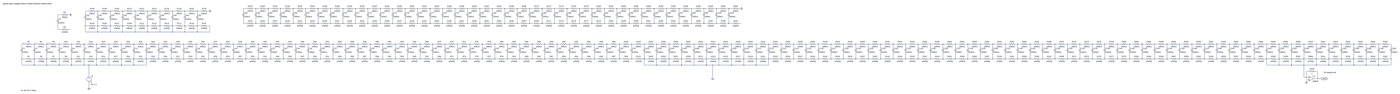
[diagram p0: schematic nstCircuitSim.asc, whole sheet]
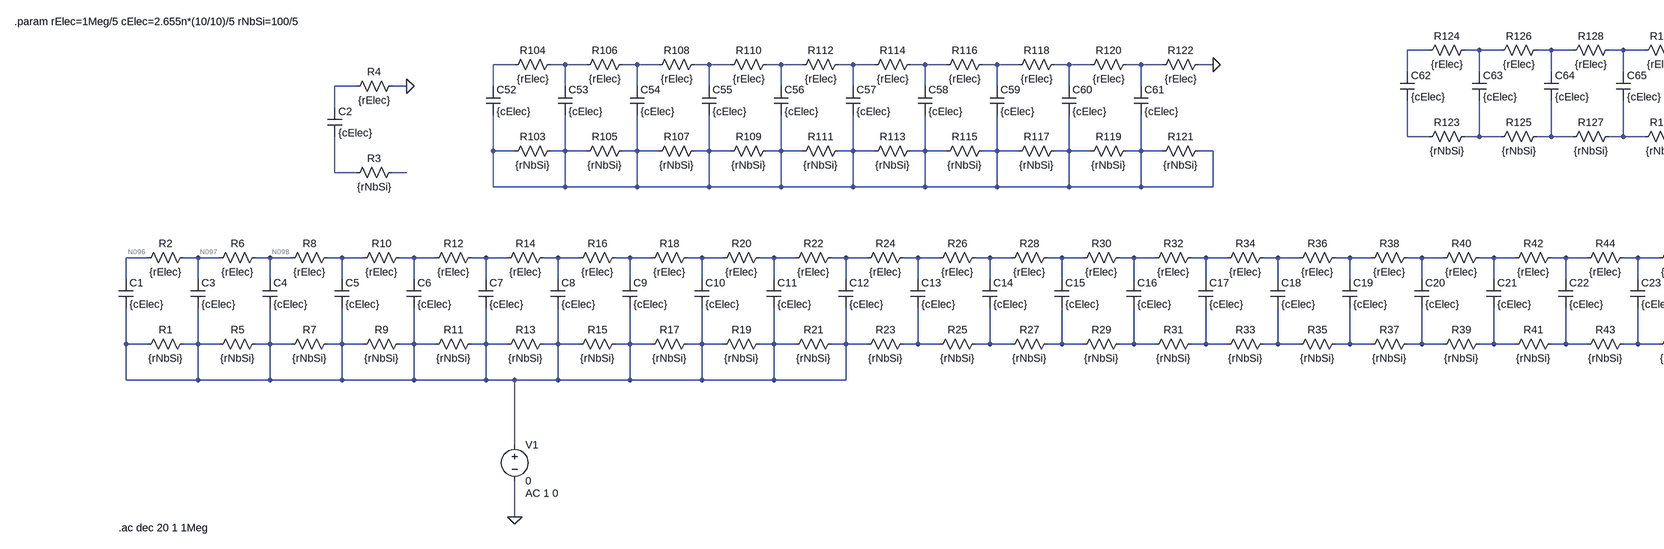
[diagram p1: schematic nstCircuitSim.asc, part, row 1 of 1, column 1 of 5]
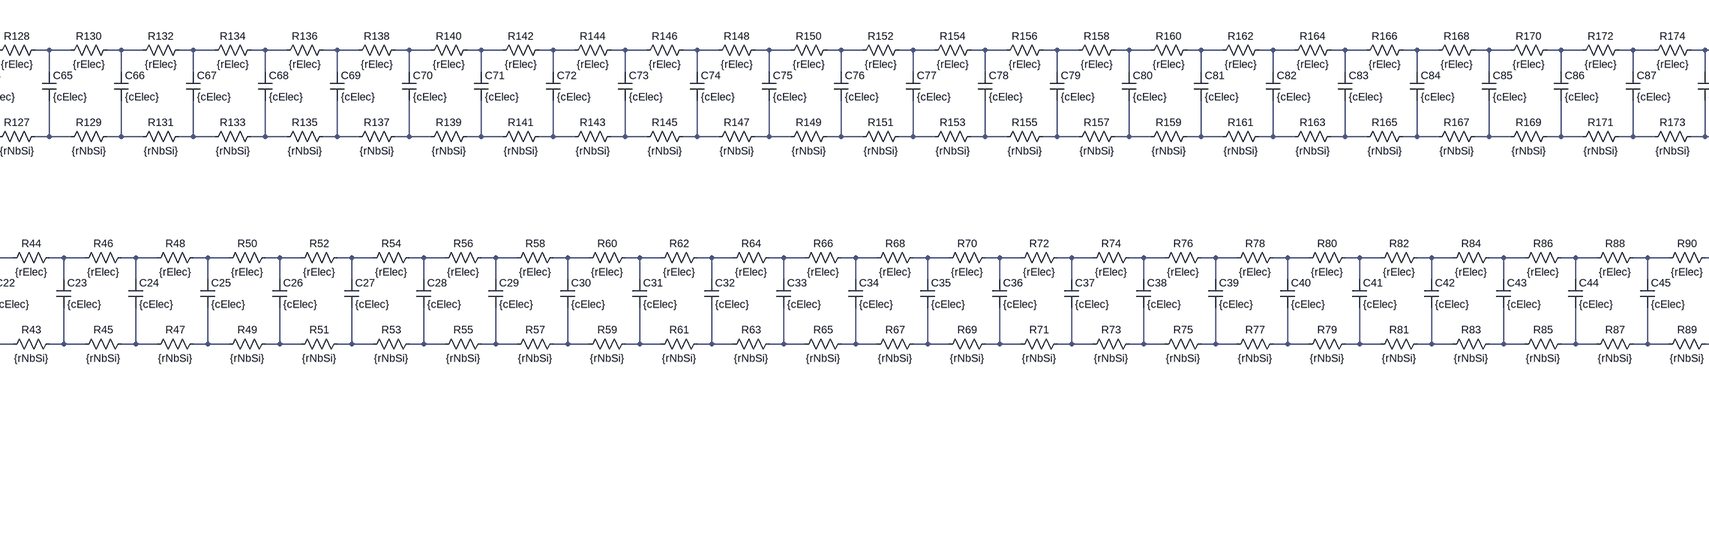
[diagram p2: schematic nstCircuitSim.asc, part, row 1 of 1, column 2 of 5]
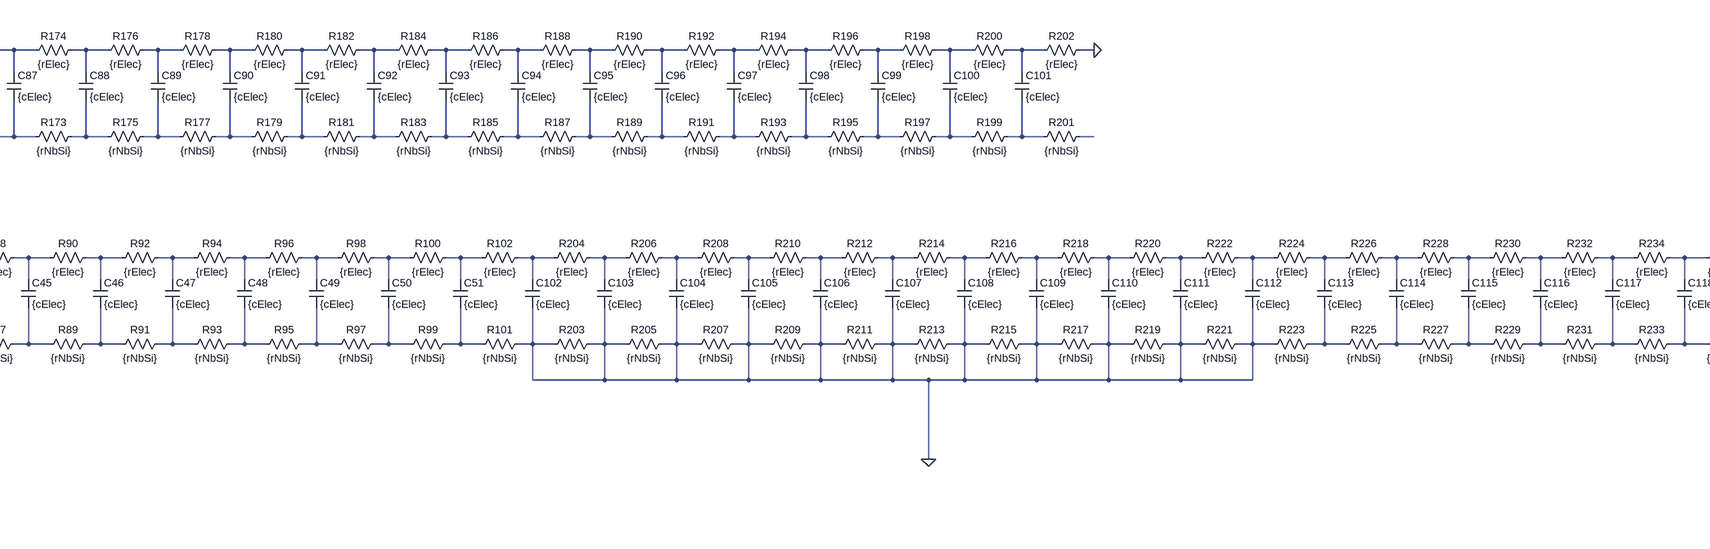
[diagram p3: schematic nstCircuitSim.asc, part, row 1 of 1, column 3 of 5]
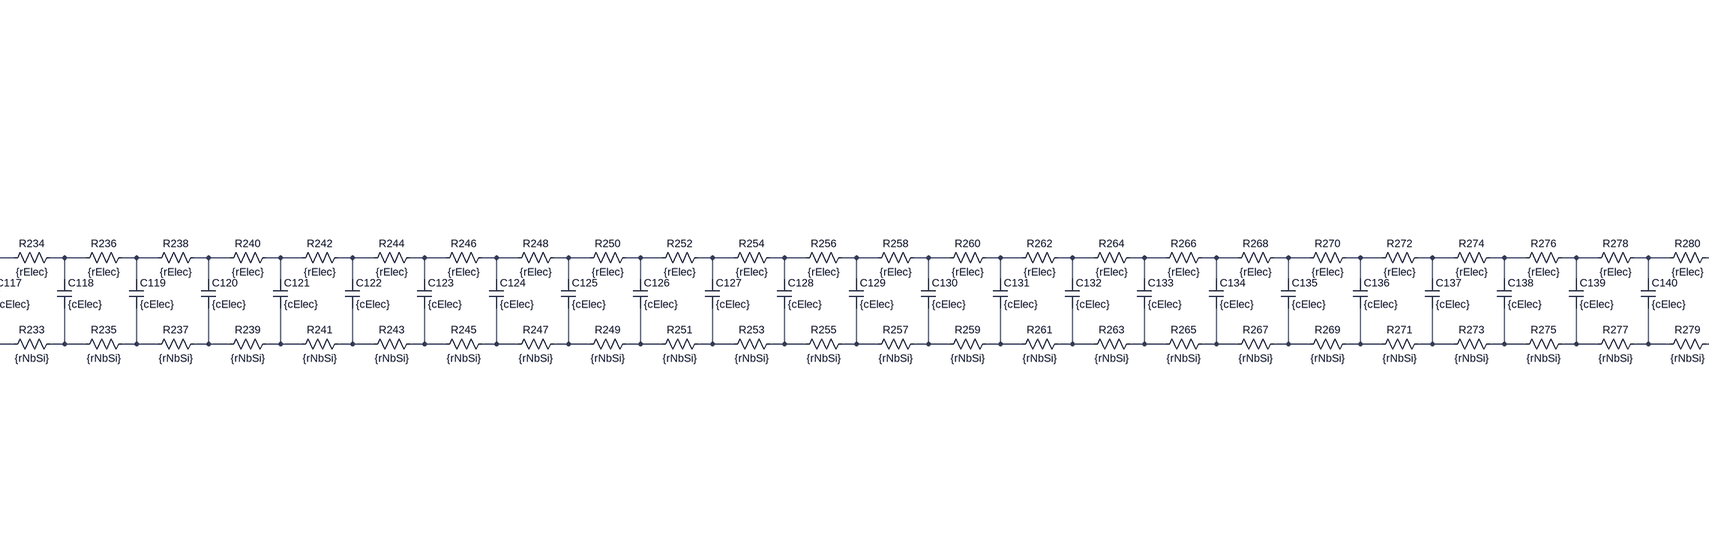
[diagram p4: schematic nstCircuitSim.asc, part, row 1 of 1, column 4 of 5]
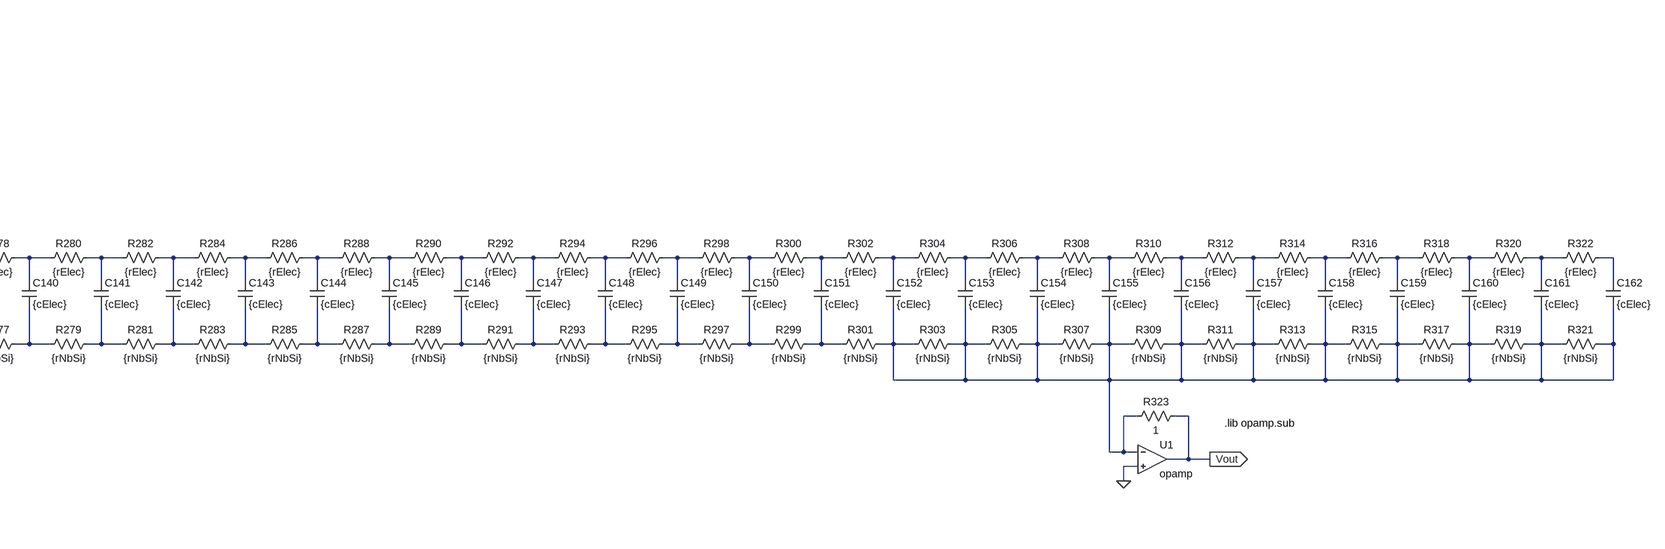
[diagram p5: schematic nstCircuitSim.asc, part, row 1 of 1, column 5 of 5]
* nstCircuitSim.asc
R1 N207 N207 {rNbSi}
R2 N097 N096 {rElec}
C1 N096 N207 {cElec}
R3 N095 N094 {rNbSi}
R4 0 N051 {rElec}
C2 N051 N094 {cElec}
R5 N207 N207 {rNbSi}
R6 N098 N097 {rElec}
C3 N097 N207 {cElec}
R7 N207 N207 {rNbSi}
R8 N099 N098 {rElec}
C4 N098 N207 {cElec}
R9 N207 N207 {rNbSi}
R10 N100 N099 {rElec}
C5 N099 N207 {cElec}
R11 N207 N207 {rNbSi}
R12 N101 N100 {rElec}
C6 N100 N207 {cElec}
R13 N207 N207 {rNbSi}
R14 N102 N101 {rElec}
C7 N101 N207 {cElec}
R15 N207 N207 {rNbSi}
R16 N103 N102 {rElec}
C8 N102 N207 {cElec}
R17 N207 N207 {rNbSi}
R18 N104 N103 {rElec}
C9 N103 N207 {cElec}
R19 N207 N207 {rNbSi}
R20 N105 N104 {rElec}
C10 N104 N207 {cElec}
R21 N207 N207 {rNbSi}
R22 N106 N105 {rElec}
C11 N105 N207 {cElec}
R23 N208 N207 {rNbSi}
R24 N107 N106 {rElec}
C12 N106 N207 {cElec}
R25 N209 N208 {rNbSi}
R26 N108 N107 {rElec}
C13 N107 N208 {cElec}
R27 N210 N209 {rNbSi}
R28 N109 N108 {rElec}
C14 N108 N209 {cElec}
R29 N211 N210 {rNbSi}
R30 N110 N109 {rElec}
C15 N109 N210 {cElec}
R31 N212 N211 {rNbSi}
R32 N111 N110 {rElec}
C16 N110 N211 {cElec}
R33 N213 N212 {rNbSi}
R34 N112 N111 {rElec}
C17 N111 N212 {cElec}
R35 N214 N213 {rNbSi}
R36 N113 N112 {rElec}
C18 N112 N213 {cElec}
R37 N215 N214 {rNbSi}
R38 N114 N113 {rElec}
C19 N113 N214 {cElec}
R39 N216 N215 {rNbSi}
R40 N115 N114 {rElec}
C20 N114 N215 {cElec}
R41 N217 N216 {rNbSi}
R42 N116 N115 {rElec}
C21 N115 N216 {cElec}
R43 N218 N217 {rNbSi}
R44 N117 N116 {rElec}
C22 N116 N217 {cElec}
R45 N219 N218 {rNbSi}
R46 N118 N117 {rElec}
C23 N117 N218 {cElec}
R47 N220 N219 {rNbSi}
R48 N119 N118 {rElec}
C24 N118 N219 {cElec}
R49 N221 N220 {rNbSi}
R50 N120 N119 {rElec}
C25 N119 N220 {cElec}
R51 N222 N221 {rNbSi}
R52 N121 N120 {rElec}
C26 N120 N221 {cElec}
R53 N223 N222 {rNbSi}
R54 N122 N121 {rElec}
C27 N121 N222 {cElec}
R55 N224 N223 {rNbSi}
R56 N123 N122 {rElec}
C28 N122 N223 {cElec}
R57 N225 N224 {rNbSi}
R58 N124 N123 {rElec}
C29 N123 N224 {cElec}
R59 N226 N225 {rNbSi}
R60 N125 N124 {rElec}
C30 N124 N225 {cElec}
R61 N227 N226 {rNbSi}
R62 N126 N125 {rElec}
C31 N125 N226 {cElec}
R63 N228 N227 {rNbSi}
R64 N127 N126 {rElec}
C32 N126 N227 {cElec}
R65 N229 N228 {rNbSi}
R66 N128 N127 {rElec}
C33 N127 N228 {cElec}
R67 N230 N229 {rNbSi}
R68 N129 N128 {rElec}
C34 N128 N229 {cElec}
R69 N231 N230 {rNbSi}
R70 N130 N129 {rElec}
C35 N129 N230 {cElec}
R71 N232 N231 {rNbSi}
R72 N131 N130 {rElec}
C36 N130 N231 {cElec}
R73 N233 N232 {rNbSi}
R74 N132 N131 {rElec}
C37 N131 N232 {cElec}
R75 N234 N233 {rNbSi}
R76 N133 N132 {rElec}
C38 N132 N233 {cElec}
R77 N235 N234 {rNbSi}
R78 N134 N133 {rElec}
C39 N133 N234 {cElec}
R79 N236 N235 {rNbSi}
R80 N135 N134 {rElec}
C40 N134 N235 {cElec}
R81 N237 N236 {rNbSi}
R82 N136 N135 {rElec}
C41 N135 N236 {cElec}
R83 N238 N237 {rNbSi}
R84 N137 N136 {rElec}
C42 N136 N237 {cElec}
R85 N239 N238 {rNbSi}
R86 N138 N137 {rElec}
C43 N137 N238 {cElec}
R87 N240 N239 {rNbSi}
R88 N139 N138 {rElec}
C44 N138 N239 {cElec}
R89 N241 N240 {rNbSi}
R90 N140 N139 {rElec}
C45 N139 N240 {cElec}
R91 N242 N241 {rNbSi}
R92 N141 N140 {rElec}
C46 N140 N241 {cElec}
R93 N243 N242 {rNbSi}
R94 N142 N141 {rElec}
C47 N141 N242 {cElec}
R95 N244 N243 {rNbSi}
R96 N143 N142 {rElec}
C48 N142 N243 {cElec}
R97 N245 N244 {rNbSi}
R98 N144 N143 {rElec}
C49 N143 N244 {cElec}
R99 N246 N245 {rNbSi}
R100 N145 N144 {rElec}
C50 N144 N245 {cElec}
R101 0 N246 {rNbSi}
R102 N146 N145 {rElec}
C51 N145 N246 {cElec}
R103 N093 N093 {rNbSi}
R104 N042 N041 {rElec}
C52 N041 N093 {cElec}
R105 N093 N093 {rNbSi}
R106 N043 N042 {rElec}
C53 N042 N093 {cElec}
R107 N093 N093 {rNbSi}
R108 N044 N043 {rElec}
C54 N043 N093 {cElec}
R109 N093 N093 {rNbSi}
R110 N045 N044 {rElec}
C55 N044 N093 {cElec}
R111 N093 N093 {rNbSi}
R112 N046 N045 {rElec}
C56 N045 N093 {cElec}
R113 N093 N093 {rNbSi}
R114 N047 N046 {rElec}
C57 N046 N093 {cElec}
R115 N093 N093 {rNbSi}
R116 N048 N047 {rElec}
C58 N047 N093 {cElec}
R117 N093 N093 {rNbSi}
R118 N049 N048 {rElec}
C59 N048 N093 {cElec}
R119 N093 N093 {rNbSi}
R120 N050 N049 {rElec}
C60 N049 N093 {cElec}
R121 N093 N093 {rNbSi}
R122 0 N050 {rElec}
C61 N050 N093 {cElec}
R123 N053 N052 {rNbSi}
R124 N002 N001 {rElec}
C62 N001 N052 {cElec}
R125 N054 N053 {rNbSi}
R126 N003 N002 {rElec}
C63 N002 N053 {cElec}
R127 N055 N054 {rNbSi}
R128 N004 N003 {rElec}
C64 N003 N054 {cElec}
R129 N056 N055 {rNbSi}
R130 N005 N004 {rElec}
C65 N004 N055 {cElec}
R131 N057 N056 {rNbSi}
R132 N006 N005 {rElec}
C66 N005 N056 {cElec}
R133 N058 N057 {rNbSi}
R134 N007 N006 {rElec}
C67 N006 N057 {cElec}
R135 N059 N058 {rNbSi}
R136 N008 N007 {rElec}
C68 N007 N058 {cElec}
R137 N060 N059 {rNbSi}
R138 N009 N008 {rElec}
C69 N008 N059 {cElec}
R139 N061 N060 {rNbSi}
R140 N010 N009 {rElec}
C70 N009 N060 {cElec}
R141 N062 N061 {rNbSi}
R142 N011 N010 {rElec}
C71 N010 N061 {cElec}
R143 N063 N062 {rNbSi}
R144 N012 N011 {rElec}
C72 N011 N062 {cElec}
R145 N064 N063 {rNbSi}
R146 N013 N012 {rElec}
C73 N012 N063 {cElec}
R147 N065 N064 {rNbSi}
R148 N014 N013 {rElec}
C74 N013 N064 {cElec}
R149 N066 N065 {rNbSi}
R150 N015 N014 {rElec}
C75 N014 N065 {cElec}
R151 N067 N066 {rNbSi}
R152 N016 N015 {rElec}
C76 N015 N066 {cElec}
R153 N068 N067 {rNbSi}
R154 N017 N016 {rElec}
C77 N016 N067 {cElec}
R155 N069 N068 {rNbSi}
R156 N018 N017 {rElec}
C78 N017 N068 {cElec}
R157 N070 N069 {rNbSi}
R158 N019 N018 {rElec}
C79 N018 N069 {cElec}
R159 N071 N070 {rNbSi}
R160 N020 N019 {rElec}
C80 N019 N070 {cElec}
R161 N072 N071 {rNbSi}
R162 N021 N020 {rElec}
C81 N020 N071 {cElec}
R163 N073 N072 {rNbSi}
R164 N022 N021 {rElec}
C82 N021 N072 {cElec}
R165 N074 N073 {rNbSi}
R166 N023 N022 {rElec}
C83 N022 N073 {cElec}
R167 N075 N074 {rNbSi}
R168 N024 N023 {rElec}
C84 N023 N074 {cElec}
R169 N076 N075 {rNbSi}
R170 N025 N024 {rElec}
C85 N024 N075 {cElec}
R171 N077 N076 {rNbSi}
R172 N026 N025 {rElec}
C86 N025 N076 {cElec}
R173 N078 N077 {rNbSi}
R174 N027 N026 {rElec}
C87 N026 N077 {cElec}
R175 N079 N078 {rNbSi}
R176 N028 N027 {rElec}
C88 N027 N078 {cElec}
R177 N080 N079 {rNbSi}
R178 N029 N028 {rElec}
C89 N028 N079 {cElec}
R179 N081 N080 {rNbSi}
R180 N030 N029 {rElec}
C90 N029 N080 {cElec}
R181 N082 N081 {rNbSi}
R182 N031 N030 {rElec}
C91 N030 N081 {cElec}
R183 N083 N082 {rNbSi}
R184 N032 N031 {rElec}
C92 N031 N082 {cElec}
R185 N084 N083 {rNbSi}
R186 N033 N032 {rElec}
C93 N032 N083 {cElec}
R187 N085 N084 {rNbSi}
R188 N034 N033 {rElec}
C94 N033 N084 {cElec}
R189 N086 N085 {rNbSi}
R190 N035 N034 {rElec}
C95 N034 N085 {cElec}
R191 N087 N086 {rNbSi}
R192 N036 N035 {rElec}
C96 N035 N086 {cElec}
R193 N088 N087 {rNbSi}
R194 N037 N036 {rElec}
C97 N036 N087 {cElec}
R195 N089 N088 {rNbSi}
R196 N038 N037 {rElec}
C98 N037 N088 {cElec}
R197 N090 N089 {rNbSi}
R198 N039 N038 {rElec}
C99 N038 N089 {cElec}
R199 N091 N090 {rNbSi}
R200 N040 N039 {rElec}
C100 N039 N090 {cElec}
R201 N092 N091 {rNbSi}
R202 0 N040 {rElec}
C101 N040 N091 {cElec}
R203 0 0 {rNbSi}
R204 N147 N146 {rElec}
C102 N146 0 {cElec}
R205 0 0 {rNbSi}
R206 N148 N147 {rElec}
C103 N147 0 {cElec}
R207 0 0 {rNbSi}
R208 N149 N148 {rElec}
C104 N148 0 {cElec}
R209 0 0 {rNbSi}
R210 N150 N149 {rElec}
C105 N149 0 {cElec}
R211 0 0 {rNbSi}
R212 N151 N150 {rElec}
C106 N150 0 {cElec}
R213 0 0 {rNbSi}
R214 N152 N151 {rElec}
C107 N151 0 {cElec}
R215 0 0 {rNbSi}
R216 N153 N152 {rElec}
C108 N152 0 {cElec}
R217 0 0 {rNbSi}
R218 N154 N153 {rElec}
C109 N153 0 {cElec}
R219 0 0 {rNbSi}
R220 N155 N154 {rElec}
C110 N154 0 {cElec}
R221 0 0 {rNbSi}
R222 N156 N155 {rElec}
C111 N155 0 {cElec}
R223 N247 0 {rNbSi}
R224 N157 N156 {rElec}
C112 N156 0 {cElec}
R225 N248 N247 {rNbSi}
R226 N158 N157 {rElec}
C113 N157 N247 {cElec}
R227 N249 N248 {rNbSi}
R228 N159 N158 {rElec}
C114 N158 N248 {cElec}
R229 N250 N249 {rNbSi}
R230 N160 N159 {rElec}
C115 N159 N249 {cElec}
R231 N251 N250 {rNbSi}
R232 N161 N160 {rElec}
C116 N160 N250 {cElec}
R233 N252 N251 {rNbSi}
R234 N162 N161 {rElec}
C117 N161 N251 {cElec}
R235 N253 N252 {rNbSi}
R236 N163 N162 {rElec}
C118 N162 N252 {cElec}
R237 N254 N253 {rNbSi}
R238 N164 N163 {rElec}
C119 N163 N253 {cElec}
R239 N255 N254 {rNbSi}
R240 N165 N164 {rElec}
C120 N164 N254 {cElec}
R241 N256 N255 {rNbSi}
R242 N166 N165 {rElec}
C121 N165 N255 {cElec}
R243 N257 N256 {rNbSi}
R244 N167 N166 {rElec}
C122 N166 N256 {cElec}
R245 N258 N257 {rNbSi}
R246 N168 N167 {rElec}
C123 N167 N257 {cElec}
R247 N259 N258 {rNbSi}
R248 N169 N168 {rElec}
C124 N168 N258 {cElec}
R249 N260 N259 {rNbSi}
R250 N170 N169 {rElec}
C125 N169 N259 {cElec}
R251 N261 N260 {rNbSi}
R252 N171 N170 {rElec}
C126 N170 N260 {cElec}
R253 N262 N261 {rNbSi}
R254 N172 N171 {rElec}
C127 N171 N261 {cElec}
R255 N263 N262 {rNbSi}
R256 N173 N172 {rElec}
C128 N172 N262 {cElec}
R257 N264 N263 {rNbSi}
R258 N174 N173 {rElec}
C129 N173 N263 {cElec}
R259 N265 N264 {rNbSi}
R260 N175 N174 {rElec}
C130 N174 N264 {cElec}
R261 N266 N265 {rNbSi}
R262 N176 N175 {rElec}
C131 N175 N265 {cElec}
R263 N267 N266 {rNbSi}
R264 N177 N176 {rElec}
C132 N176 N266 {cElec}
R265 N268 N267 {rNbSi}
R266 N178 N177 {rElec}
C133 N177 N267 {cElec}
R267 N269 N268 {rNbSi}
R268 N179 N178 {rElec}
C134 N178 N268 {cElec}
R269 N270 N269 {rNbSi}
R270 N180 N179 {rElec}
C135 N179 N269 {cElec}
R271 N271 N270 {rNbSi}
R272 N181 N180 {rElec}
C136 N180 N270 {cElec}
R273 N272 N271 {rNbSi}
R274 N182 N181 {rElec}
C137 N181 N271 {cElec}
R275 N273 N272 {rNbSi}
R276 N183 N182 {rElec}
C138 N182 N272 {cElec}
R277 N274 N273 {rNbSi}
R278 N184 N183 {rElec}
C139 N183 N273 {cElec}
R279 N275 N274 {rNbSi}
R280 N185 N184 {rElec}
C140 N184 N274 {cElec}
R281 N276 N275 {rNbSi}
R282 N186 N185 {rElec}
C141 N185 N275 {cElec}
R283 N277 N276 {rNbSi}
R284 N187 N186 {rElec}
C142 N186 N276 {cElec}
R285 N278 N277 {rNbSi}
R286 N188 N187 {rElec}
C143 N187 N277 {cElec}
R287 N279 N278 {rNbSi}
R288 N189 N188 {rElec}
C144 N188 N278 {cElec}
R289 N280 N279 {rNbSi}
R290 N190 N189 {rElec}
C145 N189 N279 {cElec}
R291 N281 N280 {rNbSi}
R292 N191 N190 {rElec}
C146 N190 N280 {cElec}
R293 N282 N281 {rNbSi}
R294 N192 N191 {rElec}
C147 N191 N281 {cElec}
R295 N283 N282 {rNbSi}
R296 N193 N192 {rElec}
C148 N192 N282 {cElec}
R297 N284 N283 {rNbSi}
R298 N194 N193 {rElec}
C149 N193 N283 {cElec}
R299 N285 N284 {rNbSi}
R300 N195 N194 {rElec}
C150 N194 N284 {cElec}
R301 N286 N285 {rNbSi}
R302 N196 N195 {rElec}
C151 N195 N285 {cElec}
R303 N286 N286 {rNbSi}
R304 N197 N196 {rElec}
C152 N196 N286 {cElec}
R305 N286 N286 {rNbSi}
R306 N198 N197 {rElec}
C153 N197 N286 {cElec}
R307 N286 N286 {rNbSi}
R308 N199 N198 {rElec}
C154 N198 N286 {cElec}
R309 N286 N286 {rNbSi}
R310 N200 N199 {rElec}
C155 N199 N286 {cElec}
R311 N286 N286 {rNbSi}
R312 N201 N200 {rElec}
C156 N200 N286 {cElec}
R313 N286 N286 {rNbSi}
R314 N202 N201 {rElec}
C157 N201 N286 {cElec}
R315 N286 N286 {rNbSi}
R316 N203 N202 {rElec}
C158 N202 N286 {cElec}
R317 N286 N286 {rNbSi}
R318 N204 N203 {rElec}
C159 N203 N286 {cElec}
R319 N286 N286 {rNbSi}
R320 N205 N204 {rElec}
C160 N204 N286 {cElec}
R321 N286 N286 {rNbSi}
R322 N206 N205 {rElec}
C161 N205 N286 {cElec}
C162 N206 N286 {cElec}
V1 N207 0 0 AC 1 0
XU1 N286 0 Vout opamp Aol=100K GBW=10Meg  ; pins invin noninvin out
R323 Vout N286 1
.param rElec=1Meg/5 cElec=2.655n*(10/10)/5 rNbSi=100/5
.ac dec 20 1 1Meg
.lib opamp.sub
.backanno
.end

* Results of the author's LTspice run, read from the files saved beside the schematic
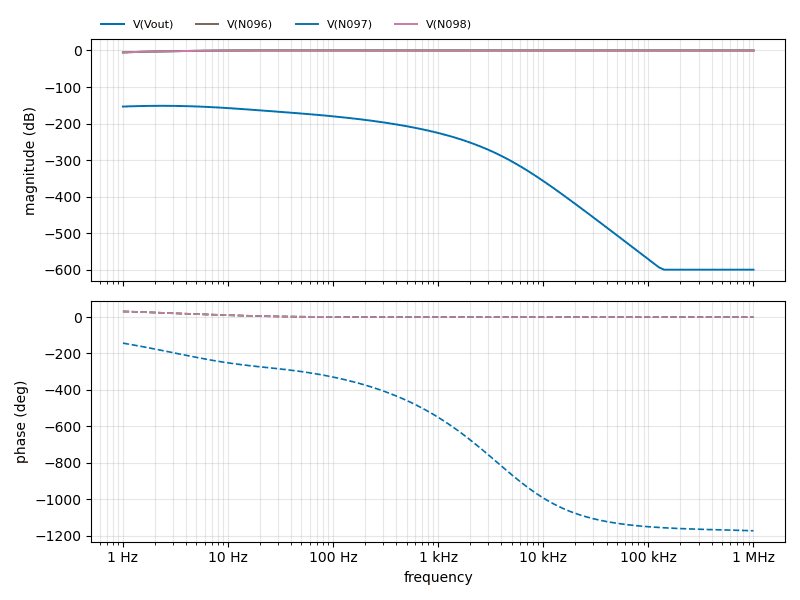
[diagram p6: AC Analysis of nstCircuitSim.asc, plotted from the saved traces]
* AC Analysis, 1 run:
*   V(Vout): -153.56 dB at 1 Hz, -600.00 dB at 1 MHz, peak -151.51 dB at 2.239 Hz, 3 dB below the peak at 6.346 Hz
*   V(N096): -5.19 dB at 1 Hz, 0.00 dB at 1 MHz, peak 0.17 dB at 39.81 Hz, 3 dB below the peak at 2.044 Hz
*   V(N097): -5.20 dB at 1 Hz, 0.00 dB at 1 MHz, peak 0.16 dB at 39.81 Hz, 3 dB below the peak at 2.042 Hz
*   V(N098): -5.21 dB at 1 Hz, 0.00 dB at 1 MHz, peak 0.14 dB at 44.67 Hz, 3 dB below the peak at 2.038 Hz